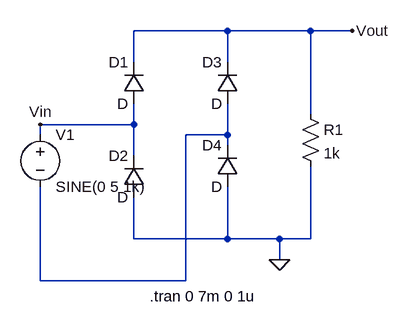
[diagram p0: schematic Full Wave.asc]
Full Wave.asc, the LTspice schematic file:
Version 4
SHEET 1 880 680
WIRE 336 0 192 0
WIRE 464 0 336 0
WIRE 528 0 464 0
WIRE 192 48 192 0
WIRE 336 48 336 0
WIRE 464 128 464 0
WIRE 192 144 192 112
WIRE 192 144 48 144
WIRE 48 160 48 144
WIRE 336 160 336 112
WIRE 336 160 272 160
WIRE 336 176 336 160
WIRE 192 192 192 144
WIRE 192 320 192 256
WIRE 336 320 336 240
WIRE 336 320 192 320
WIRE 416 320 336 320
WIRE 464 320 464 208
WIRE 464 320 416 320
WIRE 416 352 416 320
WIRE 48 384 48 240
WIRE 272 384 272 160
WIRE 272 384 48 384
FLAG 416 352 0
FLAG 48 144 Vin
FLAG 528 0 Vout
SYMBOL voltage 48 144 R0
WINDOW 123 0 0 Left 0
WINDOW 39 0 0 Left 0
SYMATTR InstName V1
SYMATTR Value SINE(0 5 1k)
SYMBOL diode 208 112 R180
WINDOW 0 24 64 Left 2
WINDOW 3 24 0 Left 2
SYMATTR InstName D1
SYMBOL diode 208 256 R180
WINDOW 0 24 64 Left 2
WINDOW 3 24 0 Left 2
SYMATTR InstName D2
SYMBOL diode 352 112 R180
WINDOW 0 24 64 Left 2
WINDOW 3 24 0 Left 2
SYMATTR InstName D3
SYMBOL diode 352 240 R180
WINDOW 0 24 64 Left 2
WINDOW 3 24 0 Left 2
SYMATTR InstName D4
SYMBOL res 448 112 R0
SYMATTR InstName R1
SYMATTR Value 1k
TEXT 216 408 Left 2 !.tran 0 7m 0 1u

The netlist it stands for:
* Full Wave.asc
V1 Vin N001 SINE(0 5 1k)
D1 Vin Vout D
D2 0 Vin D
D3 N001 Vout D
D4 0 N001 D
R1 Vout 0 1k
.model D D
.lib standard.dio
.tran 0 7m 0 1u
.backanno
.end